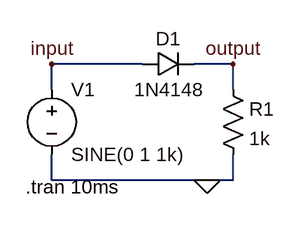
[diagram p0: schematic halfwave_rectifier.asc]
halfwave_rectifier.asc, the LTspice schematic file:
Version 4
SHEET 1 880 680
WIRE 192 96 80 96
WIRE 304 96 256 96
WIRE 80 128 80 96
WIRE 304 128 304 96
WIRE 80 240 80 208
WIRE 272 240 80 240
WIRE 304 240 304 208
WIRE 304 240 272 240
FLAG 272 240 0
FLAG 304 96 output
FLAG 80 96 input
SYMBOL voltage 80 112 R0
WINDOW 123 0 0 Left 0
WINDOW 39 0 0 Left 0
SYMATTR InstName V1
SYMATTR Value SINE(0 1 1k)
SYMBOL diode 192 112 R270
WINDOW 0 32 32 VTop 2
WINDOW 3 0 32 VBottom 2
SYMATTR InstName D1
SYMATTR Value 1N4148
SYMBOL res 288 112 R0
SYMATTR InstName R1
SYMATTR Value 1k
TEXT 48 248 Left 2 !.tran 10ms

The netlist it stands for:
* halfwave_rectifier.asc
V1 input 0 SINE(0 1 1k)
D1 input output 1N4148
R1 output 0 1k
.model D D
.lib standard.dio
.tran 10ms
.backanno
.end